# EAGLE design bluepilldbg (EAGLE 9.6.2)
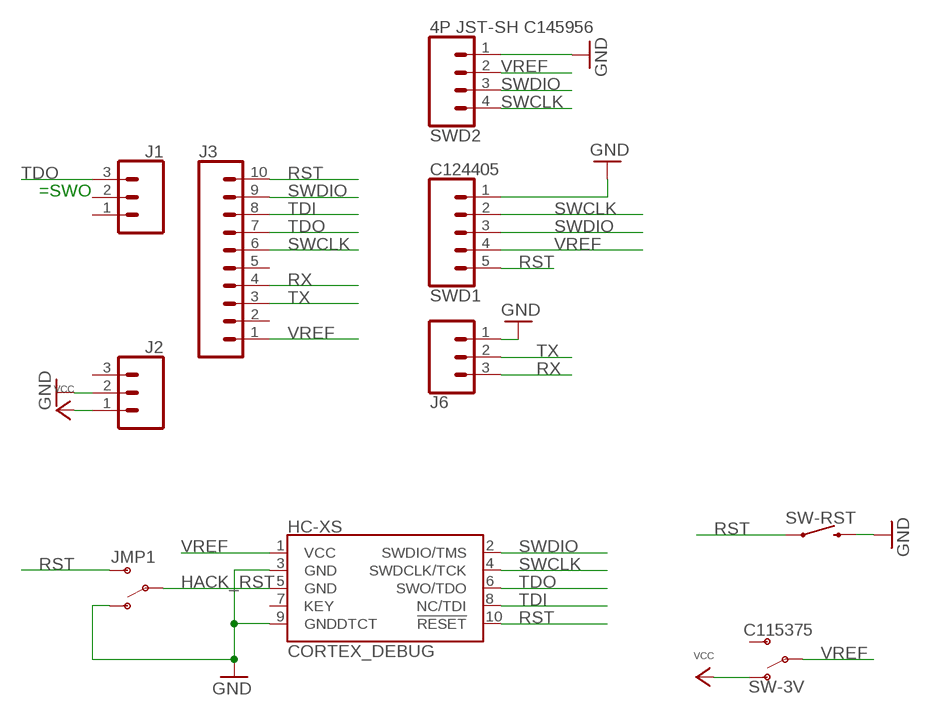
[diagram p0: schematic, sheet 1]

## Parts
HC-XS  CORTEX_DEBUG  CORTEX_DEBUG_DBG  [CON5X2_1.27]
J1  CONN_031X03_NO_SILK  [1X03_NO_SILK]
J2  CONN_031X03_NO_SILK  [1X03_NO_SILK]
J3  CONN_10NO_SILK_PTH_FEMALE  [1X10_NO_SILK]
J6  CONN_031X03_NO_SILK  [1X03_NO_SILK]
JMP1  SWITCH-SPDT-HD  [1X03_NO_SILK]
SW-3V  C115375  SWITCH-SPDT-SMD-AYZ0202  [SWITCH_DPDT_SMD_AYZ0202]
SW-RST  C255816  MOMENTARY-SWITCH-SPST-SMD-6.0X3.5MM  [TACTILE_SWITCH_SMD_6.0X3.5MM]
SWD1  C124405  CONN_05SMALLHOLE  [1X05_SMALLHOLE]
SWD2  4P JST-SH C145956  CONN_04SMD2  [JST04_1MM_RA]

## Nets
GND [power]: HC-XS.3(GND) HC-XS.9(GNDDTCT) J2.2 J6.1 JMP1.1(O) SW-RST.2 SWD1.1 SWD2.1
HACK_RST: HC-XS.5(GND) JMP1.2(P)
RST: HC-XS.10(!RESET) J3.10 JMP1.3(S) SW-RST.1 SWD1.5
RX: J3.4 J6.3
SWCLK: HC-XS.4(SWDCLK/TCK) J3.6 SWD1.2 SWD2.4
SWDIO: HC-XS.2(SWDIO/TMS) J3.9 SWD1.3 SWD2.3
TDI: HC-XS.8(NC/TDI) J3.8
TDO: HC-XS.6(SWO/TDO) J1.3 J3.7
TX: J3.3 J6.2
VCC [power]: J2.1 SW-3V.1(O) SW-3V.4(O)
VREF [power]: HC-XS.1(VCC) J3.1 SW-3V.2(P) SW-3V.5(P) SWD1.4 SWD2.2
Unconnected: HC-XS.7(KEY) J1.1 J1.2 J2.3 J3.2 J3.5 SW-3V.3(S) SW-3V.6(S)

## Notes on the sheet
- =SWO

## Library data of the parts
HC-XS = pcnt:CORTEX_DEBUG: Cortex Debug Connector - 10 pin Supports JTAG debug, Serial Wire debug, and Serial Wire Viewer. PTH and SMD connector options available. General Connector Information <http://infocenter.arm.com/help/topic/com.arm.doc.faqs/attached/13634/cortex_debug_connectors.pdf> Products: PTH Connector <http://www.digikey.com/product-detail/en/cnc-tech/3220-10-0100-00/1175-1627-ND/3883661> -via Digi-Key SparkFun PSoc <https://www.sparkfun.com/products/13229> SparkFun T <https://www.sparkfun.com/products/13810>
J1 J2 J6 = pcnt:CONN_03: Multi connection point. Often used as Generic Header-pin footprint for 0.1 inch spaced/style header connections On any of the 0.1 inch spaced packages, you can populate with these: Break Away Headers - Straight <https://www.sparkfun.com/products/116> (PRT-00116) Break Away Male Headers - Right Angle <https://www.sparkfun.com/products/553> (PRT-00553) Female Headers <https://www.sparkfun.com/products/115> (PRT-00115) Break Away Headers - Machine Pin <https://www.sparkfun.com/products/117> (PRT-00117) Break Away Female Headers - Swiss Machine Pin <https://www.sparkfun.com/products/743> (PRT-00743) Stackable Header - 3 Pin (Female, 0.1") <https://www.sparkfun.com/products/13875> (PRT-13875) For SCREWTERMINALS and SPRING TERMINALS visit here: Screw Terimnals on SparkFun.com <https://www.sparkfun.com/search/results?term=Screw+Terminals> (5mm/3.5mm/2.54mm spacing) This device is also useful as a general connection point to wire up your design to another part of your project. Our various solder wires solder well into these plated through hole pads. Hook-Up Wire - Assortment (Stranded, 22 AWG) <https://www.sparkfun.com/products/11375> (PRT-11375) Hook-Up Wire - Assortment (Solid Core, 22 AWG) <https://www.sparkfun.com/products/11367> (PRT-11367) View the entire wire category on our website here <https://www.sparkfun.com/categories/141> Special notes: Molex polarized connector foot print use with SKU : PRT-08232 with associated crimp pins and housings.
J3 = SparkFun-Connectors:CONN_10: Multi connection point. Often used as Generic Header-pin footprint for 0.1 inch spaced/style header connections On any of the 0.1 inch spaced packages, you can populate with these: Break Away Headers - Straight <https://www.sparkfun.com/products/116> (PRT-00116) Break Away Male Headers - Right Angle <https://www.sparkfun.com/products/553> (PRT-00553) Female Headers <https://www.sparkfun.com/products/115> (PRT-00115) Break Away Headers - Machine Pin <https://www.sparkfun.com/products/117> (PRT-00117) Break Away Female Headers - Swiss Machine Pin <https://www.sparkfun.com/products/743> (PRT-00743) Arduino Stackable Header - 10 Pin <https://www.sparkfun.com/products/11376> (PRT-11376) For SCREWTERMINALS and SPRING TERMINALS visit here: Screw Terimnals on SparkFun.com <https://www.sparkfun.com/search/results?term=Screw+Terminals> (5mm/3.5mm/2.54mm spacing) This device is also useful as a general connection point to wire up your design to another part of your project. Our various solder wires solder well into these plated through hole pads. Hook-Up Wire - Assortment (Stranded, 22 AWG) <https://www.sparkfun.com/products/11375> (PRT-11375) Hook-Up Wire - Assortment (Solid Core, 22 AWG) <https://www.sparkfun.com/products/11367> (PRT-11367) View the entire wire category on our website here <https://www.sparkfun.com/categories/141> Special notes: Molex polarized connector foot print use with SKU : PRT-08231 with associated crimp pins and housings. 1MM SMD Version SKU: PRT-10208 NOTES ON THE VARIANTS LOCK and LOCK_LONGPADS... This footprint was designed to help hold the alignment of a through-hole component (i.e. 6-pin header) while soldering it into place. You may notice that each hole has been shifted either up or down by 0.005 of an inch from it's more standard position (which is a perfectly straight line). This slight alteration caused the pins (the squares in the middle) to touch the edges of the holes. Because they are alternating, it causes a "brace" to hold the component in place. 0.005 has proven to be the perfect amount of "off-center" position when using our standard breakaway headers. Although looks a little odd when you look at the bare footprint, once you have a header in there, the alteration is very hard to notice. Also,if you push a header all the way into place, it is covered up entirely on the bottom side.; PROD_ID: CONN-11563
JMP1 = pcnt:SWITCH-SPDT: Single Pole, Double Throw (SPDT) Switch Single-pole, double-throw (SPDT) switch. Variant Overview SMD-AYZ0202 Surface Mount DPDT Switch <https://www.sparkfun.com/products/597> (COM-00597) Used on e.g. LilyPad Arduino USB - ATmega32U4 Board <https://www.sparkfun.com/products/12049> PTH-11.6X4.0MM SPDT Mini Power Switch <https://www.sparkfun.com/products/102> (COM-00102) Used on e.g. SparkFun Simon Says - Through-Hole Soldering Kit <https://www.sparkfun.com/products/10547> (KIT-10547) PTH-11.6X4.0MM-KIT KIT version of SPDT Mini Power Switch - Simplifies soldering by removing tStop of switch pins - only one side can be soldered. PTH-11.6X4.0MM-LOCK LOCK version of SPDT Mini Power Switch - Offset pins hold switch in place for easier soldering. SMD-RIGHT-ANGLE Surface Mount Right Angle Switch <https://www.sparkfun.com/products/10860> (COM-10860) Used on e.g. SparkFun ESP8266 Thing <https://www.sparkfun.com/products/13231>
SW-3V = pcnt:SWITCH-SPDT: Single Pole, Double Throw (SPDT) Switch Single-pole, double-throw (SPDT) switch. Variant Overview SMD-AYZ0202 Surface Mount DPDT Switch <https://www.sparkfun.com/products/597> (COM-00597) Used on e.g. LilyPad Arduino USB - ATmega32U4 Board <https://www.sparkfun.com/products/12049> PTH-11.6X4.0MM SPDT Mini Power Switch <https://www.sparkfun.com/products/102> (COM-00102) Used on e.g. SparkFun Simon Says - Through-Hole Soldering Kit <https://www.sparkfun.com/products/10547> (KIT-10547) PTH-11.6X4.0MM-KIT KIT version of SPDT Mini Power Switch - Simplifies soldering by removing tStop of switch pins - only one side can be soldered. PTH-11.6X4.0MM-LOCK LOCK version of SPDT Mini Power Switch - Offset pins hold switch in place for easier soldering. SMD-RIGHT-ANGLE Surface Mount Right Angle Switch <https://www.sparkfun.com/products/10860> (COM-10860) Used on e.g. SparkFun ESP8266 Thing <https://www.sparkfun.com/products/13231>; PROD_ID: SWCH-08179; SF_ID: COM-00597
SW-RST = mb-arcade-shield:MOMENTARY-SWITCH-SPST: Momentary Switch (Pushbutton) - SPST Normally-open (NO) SPST momentary switches (buttons, pushbuttons). Variants PTH-12MM - 12mm square, through-hole Momentary Pushbutton Switch - 12mm Square <https://www.sparkfun.com/products/9190> (COM-09190) PTH-6.0MM, PTH-6.0MM-KIT - 6.0mm square, through-hole Mini Pushbutton Switch <https://www.sparkfun.com/products/97> (COM-00097) KIT package intended for soldering kit's - only one side of pads' copper is exposed. PTH-RIGHT-ANGLE-KIT - Right-angle, through-hole Right Angle Tactile Button <https://www.sparkfun.com/products/10791> - Used on SparkFun BigTime Watch Kit <https://www.sparkfun.com/products/11734> SMD-12MM - 12mm square, surface-mount Tactile Button - SMD (12mm) <https://www.sparkfun.com/products/12993> (COM-12993) Used on SparkFun PicoBoard <https://www.sparkfun.com/products/11888> SMD-4.5MM - 4.5mm Square Trackball Switch Used on SparkFun Blackberry Trackballer Breakout <https://www.sparkfun.com/products/13169> SMD-4.6MMX2.8MM - 4.60mm x 2.80mm, surface mount Used on SparkFun SAMD21 Mini Breakout <https://www.sparkfun.com/products/13664> SMD-5.2MM, SMD-5.2-REDUNDANT - 5.2mm square, surface-mount Mini Pushbutton Switch - SMD <https://www.sparkfun.com/products/8720> (COM-08720) Used on Arduino Pro Mini <https://www.sparkfun.com/products/11114> REDUNDANT package connects both switch circuits together SMD-6.0X3.5MM - 6.0 x 3.5mm, surface mount Momentary Reset Switch SMD <https://www.sparkfun.com/products/8229> (COM-08229) SMD-6.2MM-TALL - 6.2mm square, surface mount Tactile Button - SMD (6mm) <https://www.sparkfun.com/products/12992> Used on SparkFun Digital Sandbox <https://www.sparkfun.com/products/12651> SMD-RIGHT-ANGLE - Right-angle, surface mount Used on SparkFun Block for Intel® Edison - Arduino <https://www.sparkfun.com/products/13036>; PROD_ID: SWCH-00815; SF_SKU: COM-08229
SWD1 = pcnt:CONN_05: Multi connection point. Often used as Generic Header-pin footprint for 0.1 inch spaced/style header connections On any of the 0.1 inch spaced packages, you can populate with these: Break Away Headers - Straight <https://www.sparkfun.com/products/116> (PRT-00116) Break Away Male Headers - Right Angle <https://www.sparkfun.com/products/553> (PRT-00553) Female Headers <https://www.sparkfun.com/products/115> (PRT-00115) Break Away Headers - Machine Pin <https://www.sparkfun.com/products/117> (PRT-00117) Break Away Female Headers - Swiss Machine Pin <https://www.sparkfun.com/products/743> (PRT-00743) For SCREWTERMINALS and SPRING TERMINALS visit here: Screw Terimnals on SparkFun.com <https://www.sparkfun.com/search/results?term=Screw+Terminals> (5mm/3.5mm/2.54mm spacing) This device is also useful as a general connection point to wire up your design to another part of your project. Our various solder wires solder well into these plated through hole pads. Hook-Up Wire - Assortment (Stranded, 22 AWG) <https://www.sparkfun.com/products/11375> (PRT-11375) Hook-Up Wire - Assortment (Solid Core, 22 AWG) <https://www.sparkfun.com/products/11367> (PRT-11367) View the entire wire category on our website here <https://www.sparkfun.com/categories/141> Special notes: Molex polarized connector foot print use with SKU : PRT-08231 with associated crimp pins and housings. 1MM SMD Version SKU: PRT-10208
SWD2 = pcnt:CONN_04: Multi connection point. Often used as Generic Header-pin footprint for 0.1 inch spaced/style header connections On any of the 0.1 inch spaced packages, you can populate with these: Break Away Headers - Straight <https://www.sparkfun.com/products/116> (PRT-00116) Break Away Male Headers - Right Angle <https://www.sparkfun.com/products/553> (PRT-00553) Female Headers <https://www.sparkfun.com/products/115> (PRT-00115) Break Away Headers - Machine Pin <https://www.sparkfun.com/products/117> (PRT-00117) Break Away Female Headers - Swiss Machine Pin <https://www.sparkfun.com/products/743> (PRT-00743) For SCREWTERMINALS and SPRING TERMINALS visit here: Screw Terimnals on SparkFun.com <https://www.sparkfun.com/search/results?term=Screw+Terminals> (5mm/3.5mm/2.54mm spacing) This device is also useful as a general connection point to wire up your design to another part of your project. Our various solder wires solder well into these plated through hole pads. Hook-Up Wire - Assortment (Stranded, 22 AWG) <https://www.sparkfun.com/products/11375> (PRT-11375) Hook-Up Wire - Assortment (Solid Core, 22 AWG) <https://www.sparkfun.com/products/11367> (PRT-11367) View the entire wire category on our website here <https://www.sparkfun.com/categories/141> Special notes: Molex polarized connector foot print use with SKU : PRT-08231 with associated crimp pins and housings. 1MM SMD Version SKU: PRT-10208; PROD_ID: CONN-10310; SF_ID: PRT-10208; SPICEPREFIX: S

## Net classes
0 default: width 0.152 mm
1 power: width 0.305 mm
2 gnd: width 0.305 mm
3 usbvcc: width 0.305 mm

## Board
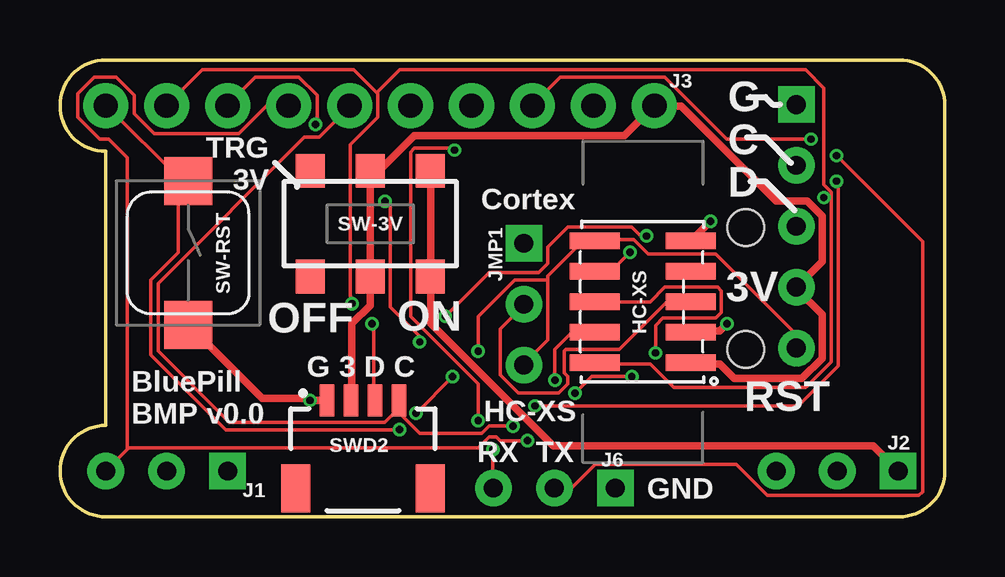
[diagram p1: board, top side]
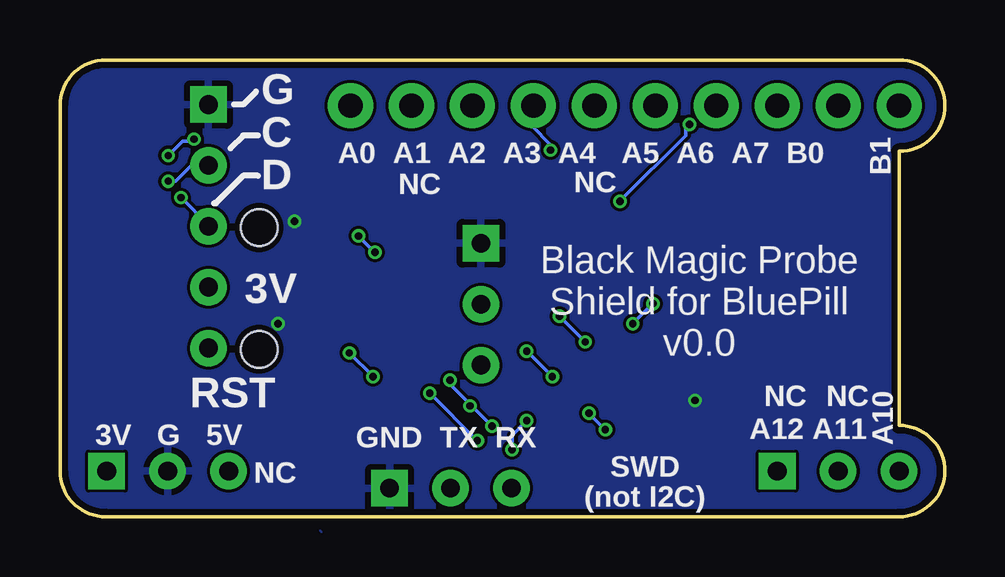
[diagram p2: board, bottom side, seen from below]

Size 36.87 x 19.05 mm. Coordinates in mm from the lower left corner, seen from the top.
Outline: 1.91,0 arc-90 0,1.91 arc-90 1.91,3.81 1.91,15.24 arc-90 0,17.14 arc-90 1.91,19.05 34.97,19.05 arc-90 36.87,17.14 36.87,1.91 arc-90 34.97,0 1.91,0
Copper layers (1*16): Top 0.035559375mm / dielectric 1.6mm / Bottom 0.035559375mm
Design rules "jlcpcb": minimum track width 5mil, minimum drill 12mil, track to track 5mil, track to pad 5mil, pad to pad 5mil, via to via 5mil, smd to smd 5mil, copper to edge 10mil, drill to drill 8mil, minimum pad ring 5mil, minimum via ring 5mil, stop-mask expansion 2.5mil, vias tented up to drill 30mil, thermal gap 10mil
Holes 1.52 mm at 28.57,6.99 28.57,12.06

### Footprints (pad centres in the part's own frame; a part is rotated, then mirrored left to right if it is on the bottom)
CON5X2_1.27 = smd 0.7 x 2.1: 1 -2.54,-2; 2 -2.54,2; 3 -1.27,-2; 4 -1.27,2; 5 0,-2; 6 0,2; 7 1.27,-2; 8 1.27,2; 9 2.54,-2; 10 2.54,2
1X03_NO_SILK = drill 0.787 pad 1.524 square: 1 0,0 | drill 0.787 pad 1.524: 2 2.54,0; 3 5.08,0
1X10_NO_SILK = drill 1.016 pad 1.88: 1 0,0; 2 2.54,0; 3 5.08,0; 4 7.62,0; 5 10.16,0; 6 12.7,0; 7 15.24,0; 8 17.78,0; 9 20.32,0; 10 22.86,0
SWITCH_DPDT_SMD_AYZ0202 = smd 1.2 x 1.4: 1 -2.5,2.2; 2 0,2.2; 3 2.5,2.2; 4 -2.5,-2.2; 5 0,-2.2; 6 2.5,-2.2
TACTILE_SWITCH_SMD_6.0X3.5MM = smd 2 x 2: 1 -3,0; 2 3,0
1X05_SMALLHOLE = drill 0.787 pad 1.524 square: 1 0,0 | drill 0.787 pad 1.524: 2 2.54,0; 3 5.08,0; 4 7.62,0; 5 10.16,0
JST04_1MM_RA = smd 0.6 x 1.35: 1 -1.5,0; 2 -0.5,0; 3 0.5,0; 4 1.5,0 | smd 1.2 x 2: NC1 2.8,-3.675; NC2 -2.8,-3.675

### Placement (x,y rotation side)
HC-XS  24.28,8.97 90 top
J1  6.99,1.91 180 top
J2  34.93,1.91 180 top
J3  24.76,17.14 180 top
J6  23.14,1.19 180 top
JMP1  19.33,11.4 270 top
SW-3V  12.93,12.22 180 top
SW-RST  5.33,11 270 top
SWD1  30.68,17.19 270 top
SWD2  12.62,4.85 0 top

### Tracks (layer width: path | path; a pad name or v marks a point on that pad's centre or on a via)
GND  (via drill 0.3)
  Top 0.305: SWD2.1 v10.41,4.85 10.34,4.93 8.43,4.93 5.38,7.98 SW-RST.2 | v27.79,8.05 27.48,7.75 26.34,7.75 HC-XS.3 | v27.1,12.32 26.34,11.56 HC-XS.9
  pour Bottom: 25.96,-0.64 arc90 26.04,-0.56
  pour Bottom: 0.11,19.11 0.11,0.11 0.36,-0.14 36.91,-0.14 36.91,17.86 35.66,19.11
HACK_RST
  Top 0.152: HC-XS.5 25.27,8.97 23.29,6.99 21.08,6.99 21.01,6.91 21.01,5.99 21.16,5.84 21.16,5.54 20.78,5.16 19.1,5.16 18.34,5.92 18.34,7.82 19.33,8.81 JMP1.2
RST  (via drill 0.3)
  Top 0.152: J3.10 1.96,17.12 5,14.07 5.31,14.07 SW-RST.1 4.93,14.07 4.93,11.02 3.79,9.88 3.79,6.76 6.91,3.63 v14.15,3.63 | 20.32,9.88 20.32,7.37 19.33,6.38 JMP1.3 | 20.32,9.88 20.32,10.03 21.77,11.48 22.22,11.48 HC-XS.10 22.3,11.56 23.9,11.56 24.51,10.95 27.33,10.95 30.68,7.6 SWD1.5 | v16.36,5.84 v14.83,4.32 | v17.42,6.91 17.42,8.36 18.95,9.88 20.32,9.88
  Bottom 0.152: v14.83,4.32 v14.15,3.63 | v17.42,6.91 v16.36,5.84
RX  (via drill 0.3)
  Top 0.152: v18.03,2.79 18.03,1.19 J6.3 | v17.42,4.01 17.42,5.54 14.61,8.36 14.61,15.21 14.76,15.37 16.36,15.37 v16.43,15.29
  Bottom 0.152: v18.03,2.79 18.03,3.4 v17.42,4.01 | v16.43,15.29 16.43,15.52 17.2,16.28 17.2,17.12 J3.4
SWCLK  (via drill 0.3)
  Top 0.152: J3.6 12.09,17.12 10.79,15.82 10.19,15.82 4.09,9.73 4.09,6.91 7.06,3.94 13.54,3.94 14.07,4.47 14.07,4.85 SWD2.4 14.07,4.39 14.99,3.48 17.58,3.48 17.88,3.79 v18.87,3.79 | v20.62,5.69 20.62,6.99 21.31,7.67 22.22,7.67 HC-XS.4 | v32.36,14 32.36,13.77 32.44,13.69 32.44,6.3 30.76,4.62 v19.79,4.62
  Bottom 0.152: v20.62,5.69 20.62,5.54 19.75,4.66 | v18.87,3.79 19.75,4.66 | v32.36,14 32.05,14 31.44,14.61 30.68,14.61 SWD1.2 | v19.79,4.62 19.75,4.66
SWDIO  (via drill 0.3)
  Top 0.152: v13.01,8.05 13.08,7.98 13.08,4.85 SWD2.3 | v12.17,8.89 12.17,9.12 12.09,9.2 12.09,15.52 13.23,16.66 13.23,17.65 13.2,17.69 | 13.2,17.69 12.24,18.64 5.92,18.64 4.47,17.2 J3.9 | 32.13,13.31 32.13,13.54 31.83,13.84 31.83,17.88 31.06,18.64 14.15,18.64 13.2,17.69 | 32.13,13.31 32.13,6.45 31.06,5.38 25.58,5.38 24.59,6.38 22.3,6.38 HC-XS.2 | 32.13,13.31 v31.83,13.31
  Bottom 0.152: v12.17,8.89 v13.01,8.05 | v31.83,13.31 30.68,12.17 SWD1.3
TDI  (via drill 0.3)
  Top 0.152: v23.75,11.02 22.99,10.26 22.3,10.26 HC-XS.8 | v24.43,11.71 24.21,11.71 23.82,12.09 21.16,12.09 20.32,11.25 20.32,10.57 19.94,10.19 17.88,10.19 v16.05,8.36 | v14.99,7.29 14.99,7.52 13.77,8.74 13.77,12.93 v13.54,13.16 | v10.64,16.36 10.64,16.59 10.72,16.66 10.72,17.58 9.96,18.34 8.13,18.34 6.99,17.2 J3.8
  Bottom 0.152: v24.43,11.71 v23.75,11.02 | v14.99,7.29 v16.05,8.36 | v13.54,13.16 10.79,15.9 10.79,16.2 v10.64,16.36
TDO  (via drill 0.3)
  Top 0.152: HC-XS.6 24.59,8.97 25.2,9.58 27.41,9.58 27.56,9.42 27.56,8.51 27.33,8.28 25.12,8.28 24.82,7.98 v24.82,6.83 | v23.82,5.84 22.15,5.84 v21.46,5.16 | v19.48,3.17 18.34,3.17 18.19,3.33 17.88,3.33 17.42,2.87 2.87,2.87 2.83,2.83 | J1.3 2.83,2.83 | J3.7 9.5,17.12 8.59,17.12 7.44,15.98 3.94,15.98 3.1,16.81 3.1,17.58 2.34,18.34 1.42,18.34 0.74,17.65 0.74,16.66 1.65,15.75 2.03,15.75 2.79,14.99 2.79,2.87 2.83,2.83
  Bottom 0.152: v23.82,5.84 v24.82,6.83 | v19.48,3.17 v21.46,5.16
TX  (via drill 0.3)
  Top 0.152: J6.2 21.31,1.19 22.3,2.18 28.17,2.18 29.46,0.89 35.79,0.89 35.94,1.04 35.94,11.48 v32.36,15.06 | v31.29,15.75 27.79,15.75 25.2,18.34 20.85,18.34 19.71,17.2 J3.3
  Bottom 0.152: v32.36,15.06 31.75,15.67 31.37,15.67 v31.29,15.75
VCC
  Top 0.305: SW-3V.4 15.44,14.38 15.44,10.03 SW-3V.1 15.44,9.88 15.44,8.05 20.55,2.95 33.88,2.95 J2.1
VREF
  Top 0.305: SWD2.2 12.17,4.85 12.17,8.05 12.93,8.81 SW-3V.2 SW-3V.5 13.01,14.53 13.39,14.53 14.76,15.9 23.52,15.9 J3.1 24.82,17.12 25.88,17.12 29.84,13.16 31.14,13.16 31.75,12.55 31.75,10.64 30.76,9.65 SWD1.4 30.68,9.5 31.75,8.43 31.75,6.6 30.91,5.77 28.09,5.77 27.48,6.38 26.34,6.38 HC-XS.1

### Text on the board
tPlace: G / C / D | TRG / 3V | Cortex | 3V | OFF | ON | G 3 D C | BluePill / BMP v0.0 | RST | HC-XS | RX TX | GND
bPlace: G / C / D | B1 | A0 A1 A2 A3 A4 A5 A6 A7 B0 | NC | NC | 3V | Black Magic Probe / Shield for BluePill / v0.0 | A10 | RST | NC | NC | A12 A11 | GND TX RX | 3V G 5V | SWD / (not I2C) | NC